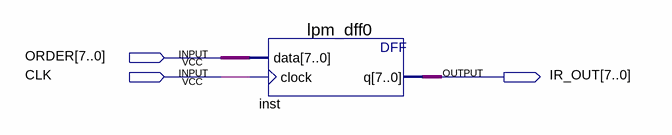
[diagram p0: schematic sheet]
// Quartus schematic IR.bdf as structural Verilog: 1 symbols, 3 pins
module IR (
  input  [7:0] ORDER,
  input  CLK,
  output [7:0] IR_OUT
);

  lpm_dff0 inst (.data(ORDER), .clock(CLK), .q(IR_OUT));
endmodule
